# Altium schematic sheet [18] RemoteSenseAmp.SchDoc: Remote Sense Amplifier
size 299 x 210 mm; SheetNumber: 18; SheetTotal: 21; PageSetup: Record=PageOptions|CenterHorizontal=True|CenterVertical=True|PrintScale=0.94|XCorrection=0.00|YCorrection=0.00|PrintKind=0|BorderSize=5000000|LeftOffset=0|BottomOffset=0|Orientation=2|PaperLength=1000|PaperWidth=1000|Scale=100|PaperSource=15|PrintQuality=600|MediaType=1|DitherType=10|PaperKind=A4|PrintScaleMode=1; Notes: No notes; Part_And_Rev: 0000-00; Drawing_Configuration: No Configuration; Adr1: August Barks gata 6B; Adr2: SE-421 32 Västra Frölunda; Adr3: Sweden; Webpage: www.omnisys.se
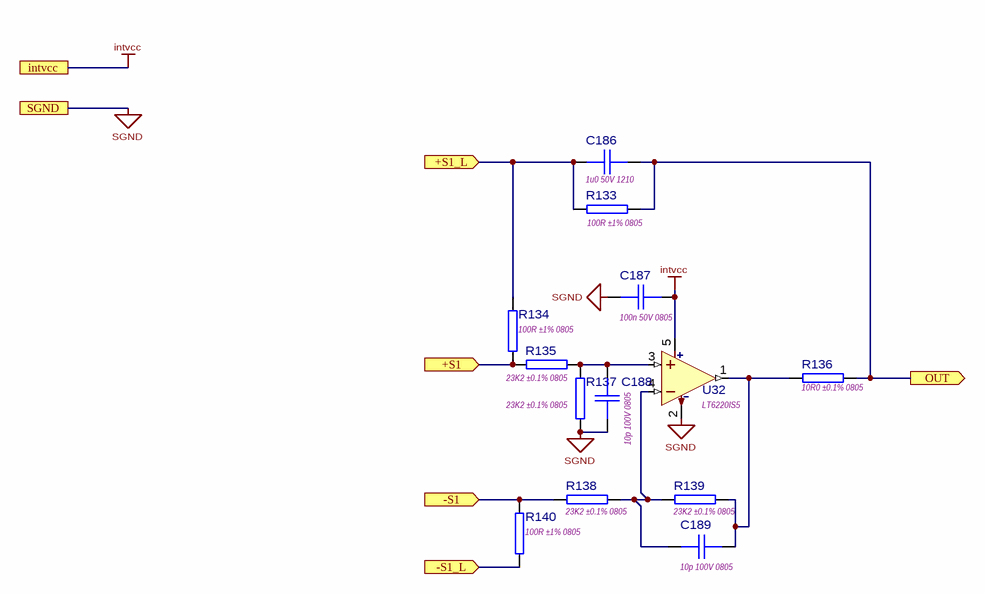
[diagram p0: [18] RemoteSenseAmp.SchDoc]

## Parts
C186  1u0 50V 1210  [CAPC3225X200N]
C187  100n 50V 0805  [CAPC2012X135N]
C188  10p 100V 0805  [CAPC2012X95N]
C189  10p 100V 0805  [CAPC2012X95N]
R133  100R ±1% 0805  [RESC2012N]
R134  100R ±1% 0805  [RESC2012N]
R135  23K2 ±0.1% 0805  [RESC2012N]
R136  10R0 ±0.1% 0805  [RESC2012N]
R137  23K2 ±0.1% 0805  [RESC2012N]
R138  23K2 ±0.1% 0805  [RESC2012N]
R139  23K2 ±0.1% 0805  [RESC2012N]
R140  100R ±1% 0805  [RESC2012N]
U32  LT6220IS5  [SOT95P280X100-5N]

## Ports
+S1 (in), +S1_L (in), -S1 (in), -S1_L (in), intvcc, OUT (out), SGND

## Nets
intvcc: C187.2 U32.5(+V) ; port intvcc
SGND: C187.1 C188.1 R137.1 U32.2(-V) ; port SGND
+S1: R134.1 R135.1 ; port +S1
+S1_L: C186.1 R133.2 R134.2 ; port +S1_L
-S1: R138.1 R140.2 ; port -S1
-S1_L: R140.1 ; port -S1_L
OUT: C186.2 R133.1 R136.1 ; port OUT
NetC188_2: C188.2 R135.2 R137.2 U32.3(+IN)
NetC189_1: C189.1 R136.2 R139.2 U32.1(OUT)
NetC189_2: C189.2 R138.2 R139.1 U32.4(-IN)

## Notes on the sheet
- August Barks gata 6B
- Omnisys Instruments AB
- Title:
- PCB ASY:
- PCB:
- SVN:
- SVN Folder:
- SE-421 32 Västra Frölunda
- www.omnisys.se
- Page:
- of
- Print date:
- Page size:
- A4
- Information contained in this drawing is confidential. Copying, distributing or use in any matter, other than that specified by OMNISYS INSTRUMENTS AB, is strictly prohibited.

## Library data of the parts
C186 = CMP-0300-002152-2: 1u0 50V X7R ±10% 1210 (3225 metric); PartNumber: GRM32RR71H105KA01; Capacitance: 1µF; Tolerance: 10%; Package: 3225/1210; Rated Voltgae: 50V; Temperature Charateristics: X7R; Thickness: 2mm
C187 = CMP-0300-002346-3: 100n 50V X7R ±10% 0805 (2012 metric); PartNumber: GRM21BR71H104KA01; Capacitance: 100nF; Tolerance: 10%; Package: 2012/0805; Rated Voltage: 50V; Temperature Charateristics: X7R; Thickness: 1.35mm
C188 C189 = CMP-0300-001122-2: 10p 100V 0805 CH +/-5% 0805 (2012 metric); PartNumber: GQM2192C2A100JB01; Tolerance: 5%; Capacitance: 10pF; Package: 2012/0805; Rated Voltage: 100V; Temperature Charateristics: CH; Thickness: 950µm
R133 R134 R140 = CMP-1800-000049-3: 100R ±1% ±100 ppm/˚C 0.125W 150V 0805 (2012 metric); Value: 100; Power: 125mW; Case-EIA: 0805; Case-Metric: 2012; Temp. Coefficent: 0.01%; Tolerance: 1%; Maximum working voltage: 150V; Technology: SMT
R135 R137-R139 = CMP-1800-001197-1: 23K2 ±0.1% ±10 ppm/˚C 0.1W 100V 0805 (2012 metric) Thinfilm; Value: 23200.00; Temp. Coefficent: 10; Tolerance: ±0.1; Case-EIA: 0805; Case-Metric: 2012; Maximum working voltage: 100V; Power: 0.1W; Technology: SMT
R136 = CMP-1800-000874-1: 10R0 ±0.1% ±10 ppm/˚C 0.1W 100V 0805 (2012 metric) Thinfilm; Tolerance: ±0.1; Value: 10.00; Case-EIA: 0805; Case-Metric: 2012; Temp. Coefficent: 10; Power: 0.1W; Maximum working voltage: 100V; Technology: SMT
U32 = CMP-2100-000514-1: 60MHz, 20V/µs, Low Power, Rail-to-Rail Input and Output; PartNumber: LT6220IS5#TRMPBF